# EAGLE schematic mrShark 08 (EAGLE 6.1)

## Sheet 1 of 4
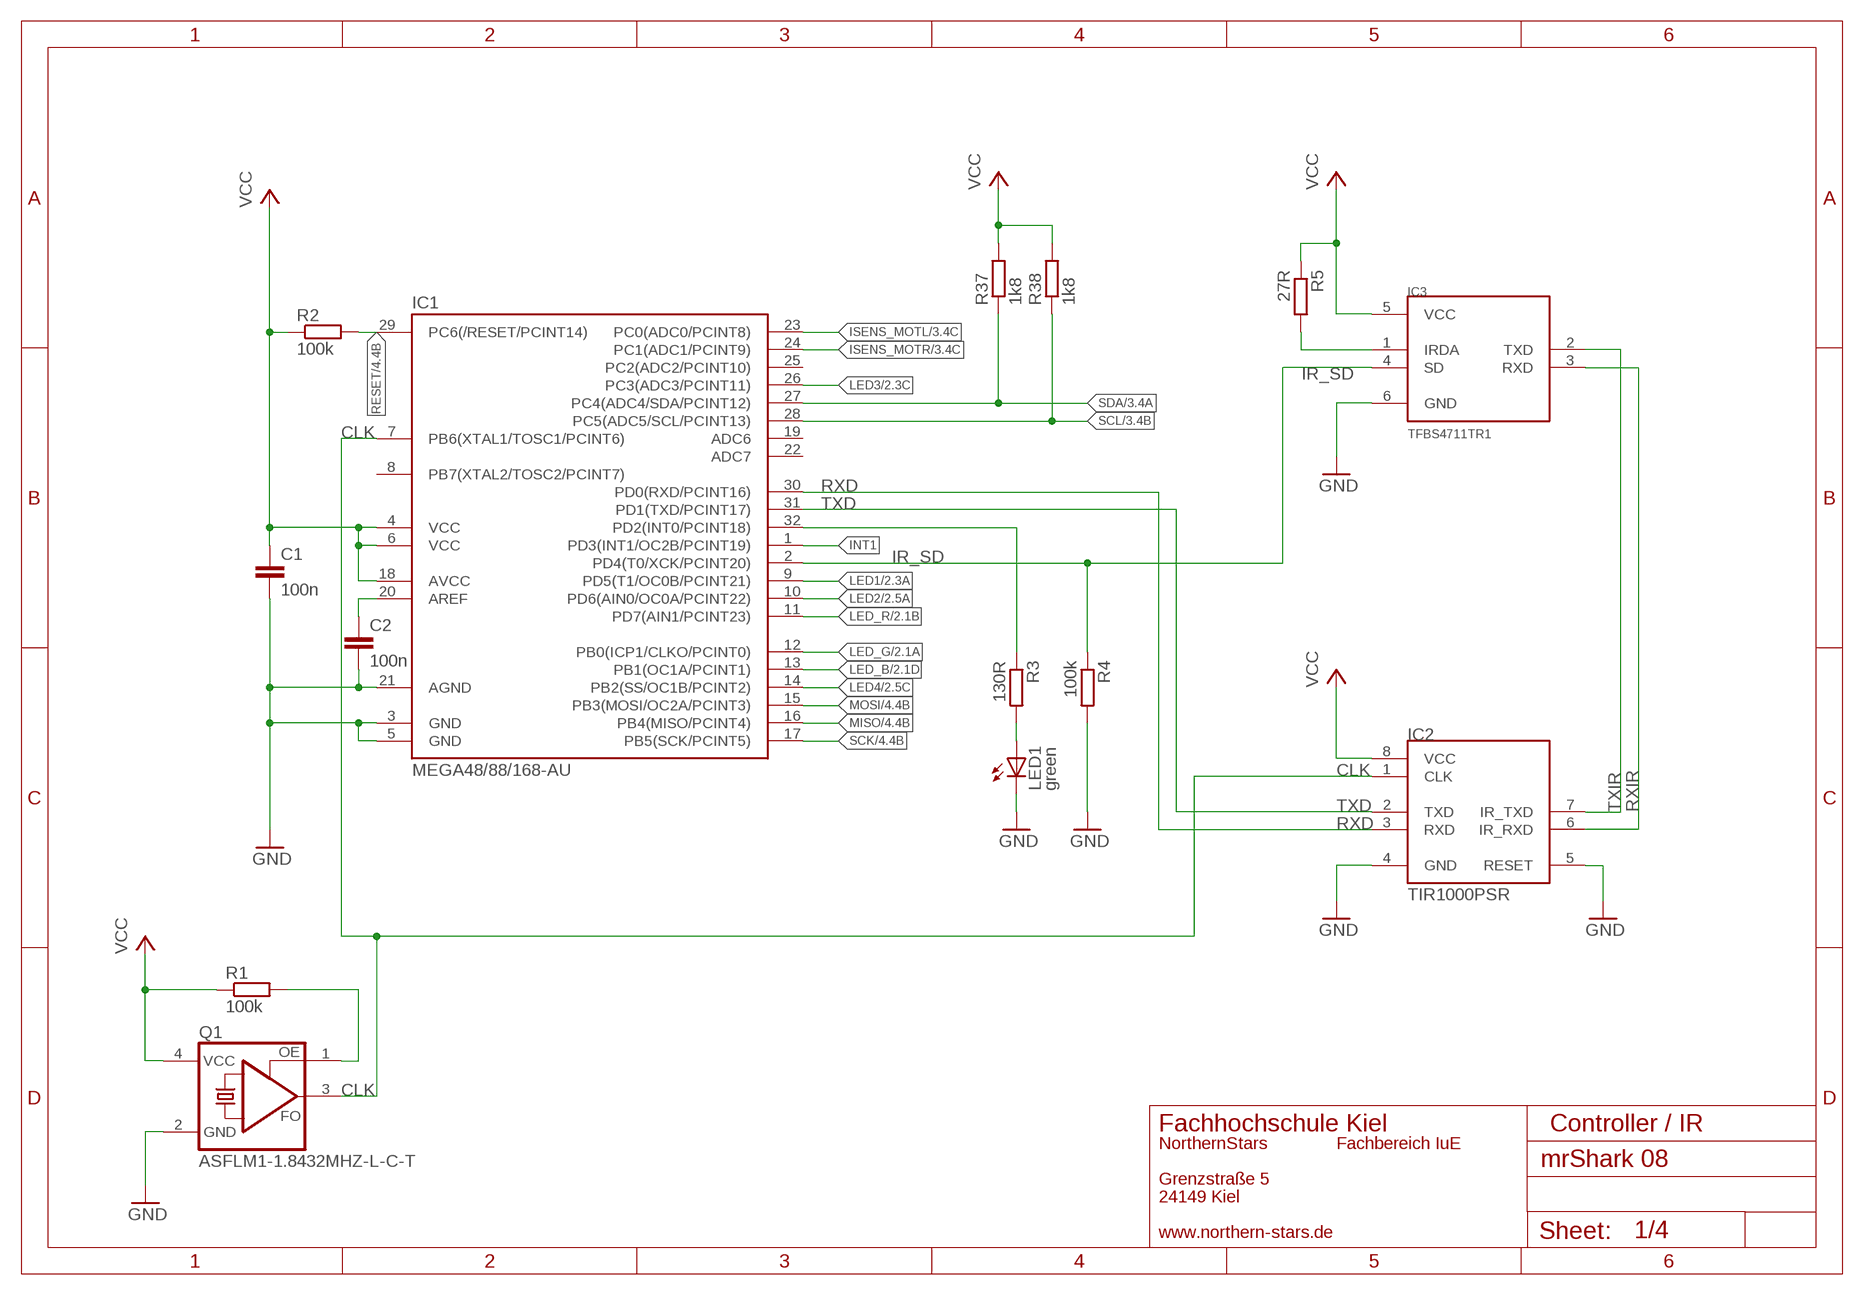
[diagram p0: schematic, sheet 1]

### Parts
C1  100n  C-EUC0805  [C0805]
C2  100n  C-EUC0805  [C0805]
IC1  MEGA48/88/168-AU  [TQFP32-08]
IC2  TIR1000PSR  [SO-08]
IC3  TFBS4711TR1  [TFBS4711]
LED1  green  LEDCHIPLED_1206  [CHIPLED_1206]
Q1  ASFLM1-1.8432MHZ-L-C-T  HC536(738)  [HC736]
R1  100k  R-EU_R1206  [R1206]
R2  100k  R-EU_R1206  [R1206]
R3  130R  R-EU_R1206  [R1206]
R4  100k  R-EU_R1206  [R1206]
R5  27R  R-EU_R1206  [R1206]
R37  1k8  R-EU_R1206  [R1206]
R38  1k8  R-EU_R1206  [R1206]

### Nets
CLK: IC1.7(PB6(XTAL1/TOSC1/PCINT6)) IC2.1(CLK) Q1.3(FO)
GND: C1.2 C2.2 IC1.3(GND) IC1.5(GND) IC1.21(AGND) IC2.4(GND) IC2.5(RESET) IC3.6(GND) LED1.C Q1.2(GND) R4.2 ; also sheet 2,3,4
INT1: IC1.1(PD3(INT1/OC2B/PCINT19))
IR_SD: IC1.2(PD4(T0/XCK/PCINT20)) IC3.4(SD) R4.1
IRDA: IC3.1(IRDA) R5.2
ISENS_MOTL: IC1.23(PC0(ADC0/PCINT8)) ; also sheet 3
ISENS_MOTR: IC1.24(PC1(ADC1/PCINT9)) ; also sheet 3
LED1: IC1.9(PD5(T1/OC0B/PCINT21)) ; also sheet 2
LED2: IC1.10(PD6(AIN0/OC0A/PCINT22)) ; also sheet 2
LED3: IC1.26(PC3(ADC3/PCINT11)) ; also sheet 2
LED4: IC1.14(PB2(SS/OC1B/PCINT2)) ; also sheet 2
LED_B: IC1.13(PB1(OC1A/PCINT1)) ; also sheet 2
LED_G: IC1.12(PB0(ICP1/CLKO/PCINT0)) ; also sheet 2
LED_R: IC1.11(PD7(AIN1/PCINT23)) ; also sheet 2
MISO: IC1.16(PB4(MISO/PCINT4)) ; also sheet 4
MOSI: IC1.15(PB3(MOSI/OC2A/PCINT3)) ; also sheet 4
N$4: Q1.1(OE) R1.2
N$26: C2.1 IC1.20(AREF)
N$29: IC1.32(PD2(INT0/PCINT18)) R3.1
N$30: LED1.A R3.2
RESET: IC1.29(PC6(/RESET/PCINT14)) R2.2 ; also sheet 4
RXD: IC1.30(PD0(RXD/PCINT16)) IC2.3(RXD)
RXIR: IC2.6(IR_RXD) IC3.3(RXD)
SCK: IC1.17(PB5(SCK/PCINT5)) ; also sheet 4
SCL: IC1.28(PC5(ADC5/SCL/PCINT13)) R38.1 ; also sheet 3
SDA: IC1.27(PC4(ADC4/SDA/PCINT12)) R37.1 ; also sheet 3
TXD: IC1.31(PD1(TXD/PCINT17)) IC2.2(TXD)
TXIR: IC2.7(IR_TXD) IC3.2(TXD)
VCC: C1.1 IC1.4(VCC) IC1.6(VCC) IC1.18(AVCC) IC2.8(VCC) IC3.5(VCC) Q1.4(VCC) R1.1 R2.1 R5.1 R37.2 R38.2 ; also sheet 2,3,4
Unconnected: IC1.8(PB7(XTAL2/TOSC2/PCINT7)) IC1.19(ADC6) IC1.22(ADC7) IC1.25(PC2(ADC2/PCINT10))

### Notes on the sheet
- Fachhochschule Kiel | Controller / IR
- NorthernStars | Fachbereich IuE
- Grenzstraße 5
- 24149 Kiel
- www.northern-stars.de

## Sheet 2 of 4
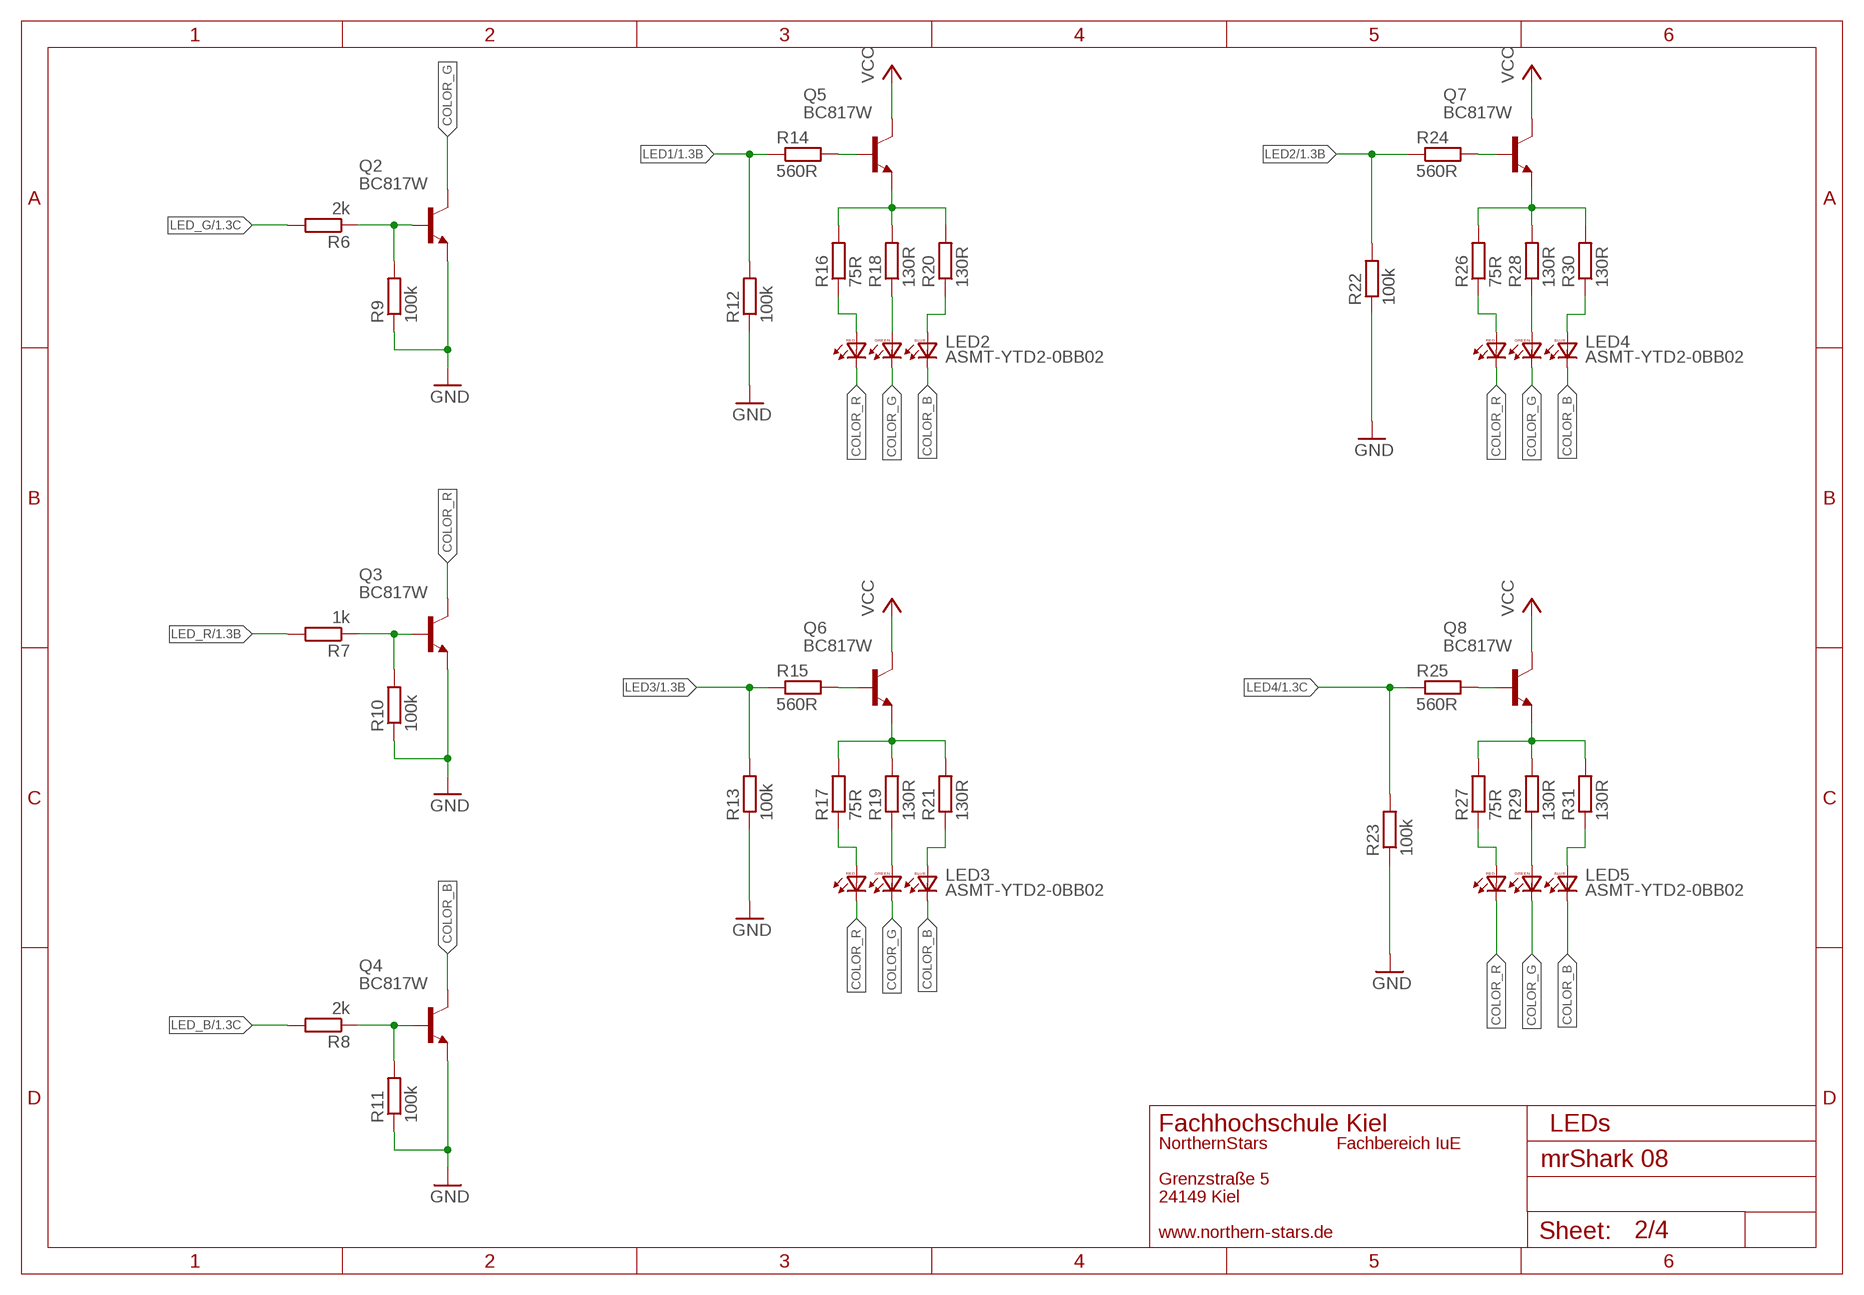
[diagram p1: schematic, sheet 2]

### Parts
LED2  ASMT-YTD2-0BB02  PLCC6K  [PLCC6K]
LED3  ASMT-YTD2-0BB02  PLCC6K  [PLCC6K]
LED4  ASMT-YTD2-0BB02  PLCC6K  [PLCC6K]
LED5  ASMT-YTD2-0BB02  PLCC6K  [PLCC6K]
Q2  BC817W  [SOT323-BEC]
Q3  BC817W  [SOT323-BEC]
Q4  BC817W  [SOT323-BEC]
Q5  BC817W  [SOT323-BEC]
Q6  BC817W  [SOT323-BEC]
Q7  BC817W  [SOT323-BEC]
Q8  BC817W  [SOT323-BEC]
R6  2k  R-EU_R1206  [R1206]
R7  1k  R-EU_R1206  [R1206]
R8  2k  R-EU_R1206  [R1206]
R9  100k  R-EU_R1206  [R1206]
R10  100k  R-EU_R1206  [R1206]
R11  100k  R-EU_R1206  [R1206]
R12  100k  R-EU_R1206  [R1206]
R13  100k  R-EU_R1206  [R1206]
R14  560R  R-EU_R1206  [R1206]
R15  560R  R-EU_R1206  [R1206]
R16  75R  R-EU_R1206  [R1206]
R17  75R  R-EU_R1206  [R1206]
R18  130R  R-EU_R1206  [R1206]
R19  130R  R-EU_R1206  [R1206]
R20  130R  R-EU_R1206  [R1206]
R21  130R  R-EU_R1206  [R1206]
R22  100k  R-EU_R1206  [R1206]
R23  100k  R-EU_R1206  [R1206]
R24  560R  R-EU_R1206  [R1206]
R25  560R  R-EU_R1206  [R1206]
R26  75R  R-EU_R1206  [R1206]
R27  75R  R-EU_R1206  [R1206]
R28  130R  R-EU_R1206  [R1206]
R29  130R  R-EU_R1206  [R1206]
R30  130R  R-EU_R1206  [R1206]
R31  130R  R-EU_R1206  [R1206]

### Nets
COLOR_B: LED2.1(BC) LED3.1(BC) LED4.1(BC) LED5.1(BC) Q4.C
COLOR_G: LED2.2(GC) LED3.2(GC) LED4.2(GC) LED5.2(GC) Q2.C
COLOR_R: LED2.3(RC) LED3.3(RC) LED4.3(RC) LED5.3(RC) Q3.C
GND: Q2.E Q3.E Q4.E R9.1 R10.1 R11.1 R12.1 R13.1 R22.1 R23.1 ; also sheet 1,3,4
LED1: R12.2 R14.1 ; also sheet 1
LED2: R22.2 R24.1 ; also sheet 1
LED3: R13.2 R15.1 ; also sheet 1
LED4: R23.2 R25.1 ; also sheet 1
LED_B: R8.2 ; also sheet 1
LED_G: R6.2 ; also sheet 1
LED_R: R7.2 ; also sheet 1
N$5: LED2.4(RA) R16.1
N$8: LED2.5(GA) R18.1
N$9: Q5.E R16.2 R18.2 R20.2
N$10: LED4.4(RA) R26.1
N$11: LED4.5(GA) R28.1
N$12: LED4.6(BA) R30.1
N$13: Q7.E R26.2 R28.2 R30.2
N$14: Q6.E R17.2 R19.2 R21.2
N$15: LED3.4(RA) R17.1
N$16: LED3.5(GA) R19.1
N$17: LED3.6(BA) R21.1
N$18: Q8.E R27.2 R29.2 R31.2
N$19: Q6.B R15.2
N$20: LED5.4(RA) R27.1
N$21: LED5.5(GA) R29.1
N$22: LED5.6(BA) R31.1
N$23: Q8.B R25.2
N$24: Q7.B R24.2
N$25: Q5.B R14.2
N$27: LED2.6(BA) R20.1
VCC: Q5.C Q6.C Q7.C Q8.C ; also sheet 1,3,4
X1: Q4.B R8.1 R11.2
X2: Q3.B R7.1 R10.2
X3: Q2.B R6.1 R9.2

### Notes on the sheet
- Fachhochschule Kiel | LEDs
- NorthernStars | Fachbereich IuE
- Grenzstraße 5
- 24149 Kiel
- www.northern-stars.de

## Sheet 3 of 4
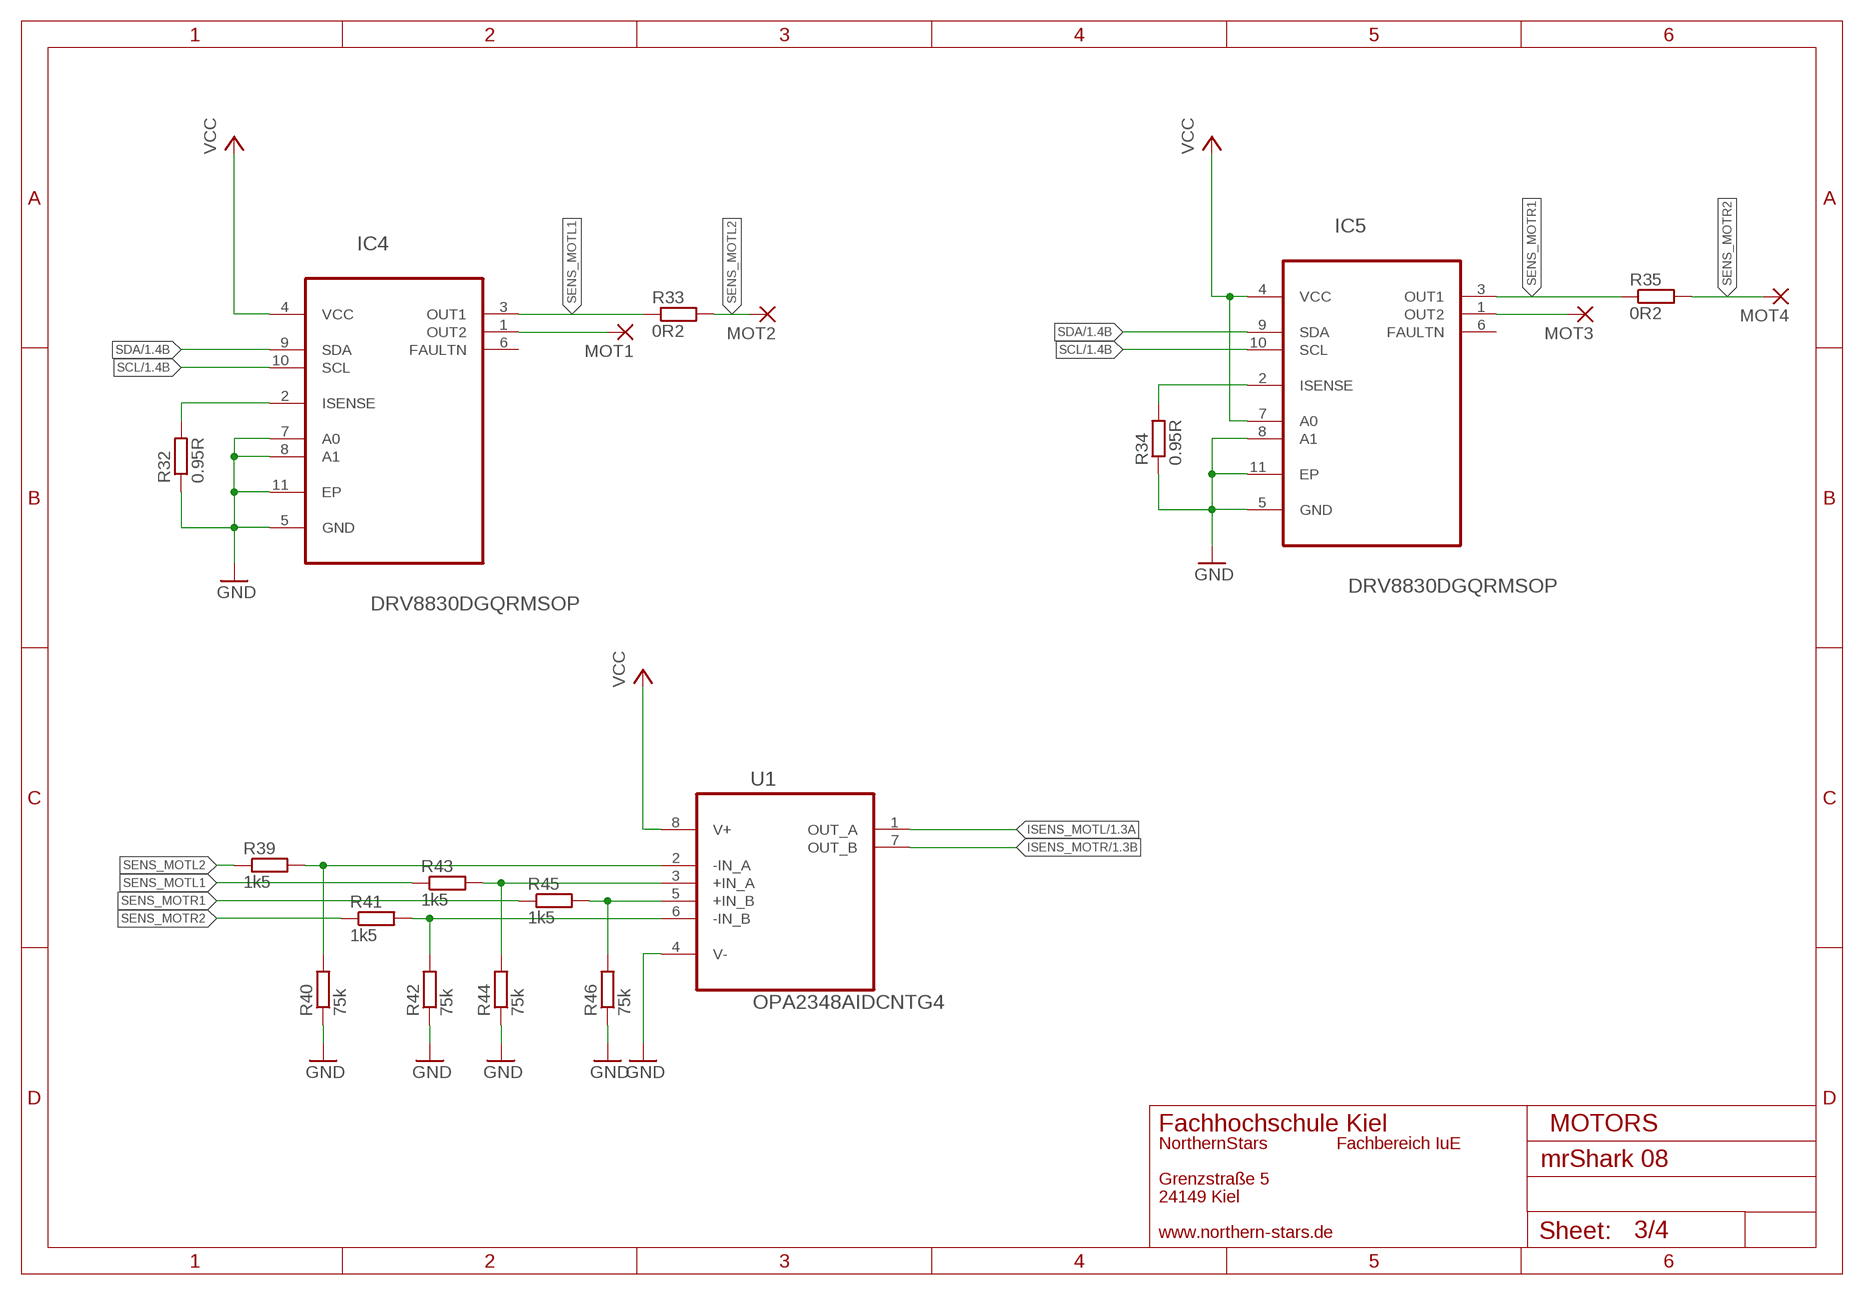
[diagram p2: schematic, sheet 3]

### Parts
IC4  DRV8830DGQRMSOP  [SOP65P640X110-15N]
IC5  DRV8830DGQRMSOP  [SOP65P640X110-15N]
MOT1  1,6/0,9  [1,6/0,9]
MOT2  1,6/0,9  [1,6/0,9]
MOT3  1,6/0,9  [1,6/0,9]
MOT4  1,6/0,9  [1,6/0,9]
R32  0.95R  R-EU_R1206  [R1206]
R33  0R2  R-EU_R0805  [R0805]
R34  0.95R  R-EU_R1206  [R1206]
R35  0R2  R-EU_R0805  [R0805]
R39  1k5  R-EU_R1206  [R1206]
R40  75k  R-EU_R1206  [R1206]
R41  1k5  R-EU_R1206  [R1206]
R42  75k  R-EU_R1206  [R1206]
R43  1k5  R-EU_R1206  [R1206]
R44  75k  R-EU_R1206  [R1206]
R45  1k5  R-EU_R1206  [R1206]
R46  75k  R-EU_R1206  [R1206]
U1  OPA2348AIDCNTG4  [SOT65P280X145-8N]

### Nets
GND: IC4.5(GND) IC4.7(A0) IC4.8(A1) IC4.11(EP) IC5.5(GND) IC5.8(A1) IC5.11(EP) R32.1 R34.1 R40.1 R42.1 R44.1 R46.1 U1.4(V-) ; also sheet 1,2,4
ISENS_MOTL: U1.1(OUT_A) ; also sheet 1
ISENS_MOTR: U1.7(OUT_B) ; also sheet 1
N$1: IC4.1(OUT2) MOT1.1(P)
N$2: IC4.2(ISENSE) R32.2
N$3: R39.2 R40.2 U1.2(-IN_A)
N$6: IC5.1(OUT2) MOT3.1(P)
N$7: IC5.2(ISENSE) R34.2
N$31: R41.2 R42.2 U1.6(-IN_B)
N$32: R43.2 R44.2 U1.3(+IN_A)
N$33: R45.2 R46.2 U1.5(+IN_B)
SCL: IC4.10(SCL) IC5.10(SCL) ; also sheet 1
SDA: IC4.9(SDA) IC5.9(SDA) ; also sheet 1
SENS_MOTL1: IC4.3(OUT1) R33.1 R43.1
SENS_MOTL2: MOT2.1(P) R33.2 R39.1
SENS_MOTR1: IC5.3(OUT1) R35.1 R45.1
SENS_MOTR2: MOT4.1(P) R35.2 R41.1
VCC: IC4.4(VCC) IC5.4(VCC) IC5.7(A0) U1.8(V+) ; also sheet 1,2,4
Unconnected: IC4.6(FAULTN) IC5.6(FAULTN)

### Notes on the sheet
- Fachhochschule Kiel | MOTORS
- NorthernStars | Fachbereich IuE
- Grenzstraße 5
- 24149 Kiel
- www.northern-stars.de

## Sheet 4 of 4
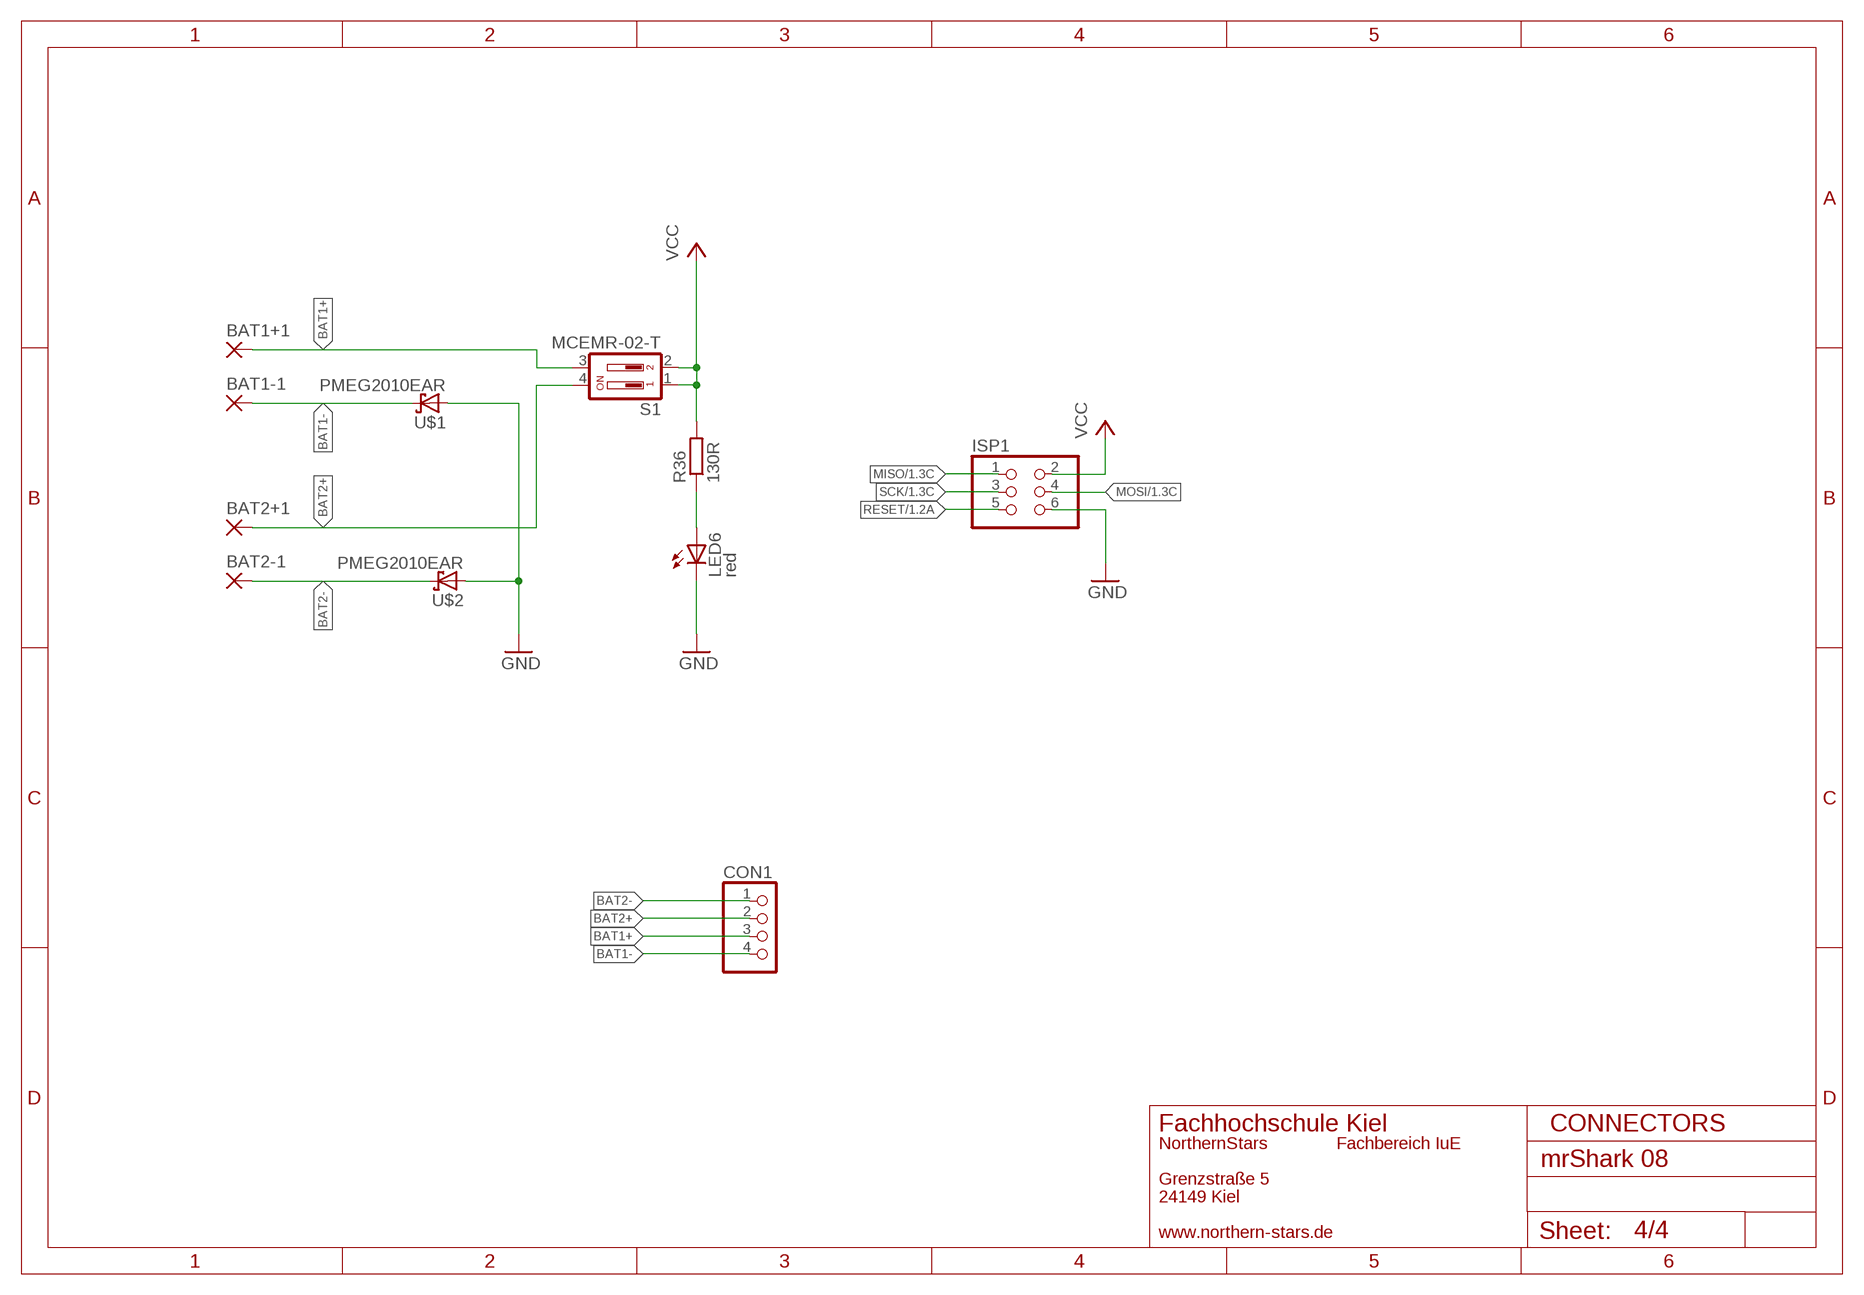
[diagram p3: schematic, sheet 4]

### Parts
BAT1+1  1,6/0,9  [1,6/0,9]
BAT1-1  1,6/0,9  [1,6/0,9]
BAT2+1  1,6/0,9  [1,6/0,9]
BAT2-1  1,6/0,9  [1,6/0,9]
CON1  PINHD-1X04_2.54-SMD-90°  [1X04SMD/90]
ISP1  PINHD-2X03_2.54-SMD  [2X03SMD]
LED6  red  LEDCHIPLED_1206  [CHIPLED_1206]
R36  130R  R-EU_R1206  [R1206]
S1  MCEMR-02-T  219-02  [CTS-219-02]
U$1  PMEG2010EAR  [SOD323-R]
U$2  PMEG2010EAR  [SOD323-R]

### Nets
BAT1+: BAT1+1.1(P) CON1.3 S1.3
BAT1-: BAT1-1.1(P) CON1.4 U$1.C
BAT2+: BAT2+1.1(P) CON1.2 S1.4
BAT2-: BAT2-1.1(P) CON1.1 U$2.C
GND: ISP1.6 LED6.C U$1.A U$2.A ; also sheet 1,2,3
MISO: ISP1.1 ; also sheet 1
MOSI: ISP1.4 ; also sheet 1
N$28: LED6.A R36.1
RESET: ISP1.5 ; also sheet 1
SCK: ISP1.3 ; also sheet 1
VCC: ISP1.2 R36.2 S1.1 S1.2 ; also sheet 1,2,3

### Notes on the sheet
- Fachhochschule Kiel | CONNECTORS
- NorthernStars | Fachbereich IuE
- Grenzstraße 5
- 24149 Kiel
- www.northern-stars.de

## Library data of the parts
BAT1+1 BAT1-1 BAT2+1 BAT2-1 MOT1-MOT4 = wirepad:1,6/0,9: THROUGH-HOLE PAD
C1 C2 = rcl:C-EU: CAPACITOR, European symbol
CON1 = pinhead-2:PINHD-1X04: PIN HEADER
IC1 = avr-6:MEGA48/88/168
IC2 = texas:TIR1000: Texas Instruments TIR1000 STANDALONE IrDATM ENCODER AND DECODER
IC3 = vishay:TFBS4711: TRANSCEIVER IRDA Vishay TFBS4711-TR1 Infrared Transciever 900nm, 600µA, 1m range
IC4 IC5 = texas:DRV8830DGQR: LOW-VOLTAGE MOTOR DRIVER WITH SERIAL INTERFACE; MPN: DRV8830DGQR; OC_FARNELL: 1863106; OC_NEWARK: 58T1482; PACKAGE: MSOP-10; SUPPLIER: TEXAS INSTRUMENTS
ISP1 = pinhead-2:PINHD-2X03: PIN HEADER
LED1 LED6 = led:LED: LED OSRAM: - CHIPLED LG R971, LG N971, LY N971, LG Q971, LY Q971, LO R971, LY R971 LH N974, LH R974 LS Q976, LO Q976, LY Q976 LO Q996 - Hyper CHIPLED LW Q18S LB Q993, LB Q99A, LB R99A - SideLED LS A670, LO A670, LY A670, LG A670, LP A670 LB A673, LV A673, LT A673, LW A673 LH A674 LY A675 LS A676, LA A676, LO A676, LY A676, LW A676 LS A679, LY A679, LG A679 - Hyper Micro SIDELED® LS Y876, LA Y876, LO Y876, LY Y876 LT Y87S - SmartLED LW L88C, LW L88S LB L89C, LB L89S, LG L890 LS L89K, LO L89K, LY L89K LS L896, LA L896, LO L896, LY L896 - TOPLED LS T670, LO T670, LY T670, LG T670, LP T670 LSG T670, LSP T670, LSY T670, LOP T670, LYG T670 LG T671, LOG T671, LSG T671 LB T673, LV T673, LT T673, LW T673 LH T674 LS T676, LA T676, LO T676, LY T676, LB T676, LH T676, LSB T676, LW T676 LB T67C, LV T67C, LT T67C, LS T67K, LO T67K, LY T67K, LW E67C LS E67B, LA E67B, LO E67B, LY E67B, LB E67C, LV E67C, LT E67C LW T67C LS T679, LY T679, LG T679 LS T770, LO T770, LY T770, LG T770, LP T770 LB T773, LV T773, LT T773, LW T773 LH T774 LS E675, LA E675, LY E675, LS T675 LS T776, LA T776, LO T776, LY T776, LB T776 LHGB T686 LT T68C, LB T68C - Hyper Mini TOPLED® LB M676 - Mini TOPLED Santana® LG M470 LS M47K, LO M47K, LY M47K Source: http://www.osram.convergy.de LUXEON: - LUMILED® LXK2-PW12-R00, LXK2-PW12-S00, LXK2-PW14-U00, LXK2-PW14-V00 LXK2-PM12-R00, LXK2-PM12-S00, LXK2-PM14-U00 LXK2-PE12-Q00, LXK2-PE12-R00, LXK2-PE12-S00, LXK2-PE14-T00, LXK2-PE14-U00 LXK2-PB12-K00, LXK2-PB12-L00, LXK2-PB12-M00, LXK2-PB14-N00, LXK2-PB14-P00, LXK2-PB14-Q00 LXK2-PR12-L00, LXK2-PR12-M00, LXK2-PR14-Q00, LXK2-PR14-R00 LXK2-PD12-Q00, LXK2-PD12-R00, LXK2-PD12-S00 LXK2-PH12-R00, LXK2-PH12-S00 LXK2-PL12-P00, LXK2-PL12-Q00, LXK2-PL12-R00 Source: www.luxeon.com KINGBRIGHT: KA-3528ASYC Source: www.kingbright.com
LED2-LED5 = led:PLCC6: Standart PLCC6 Package RGB LED
Q1 = crystal:HC536: Crystal HC536R For example: Fox Electronics FOX-HC536R
Q2-Q8 = transistor-npn:BC817*: NPN Transistor
R1-R46 = rcl:R-EU_: RESISTOR, European symbol
S1 = switch-dil:219-02*: Surface Mount DIP Switch Series 219 SMT CTS Electronic Components Sourc: www.ctscorp.com
U1 = texas:OPA2348AIDCNTG4: OPERATIONAL AMPLIFIERS; MPN: OPA2348AIDCNTG4; OC_FARNELL: 1207098; OC_NEWARK: 97K6805; PACKAGE: SOT23-8; SUPPLIER: Texas Instruments
U$1 U$2 = diode:PMEG2010EA: NXP - Low V F (MEGA) Schottky barrier diode If = 1A, Vr = 20V http://www.farnell.com/datasheets/687996.pdf